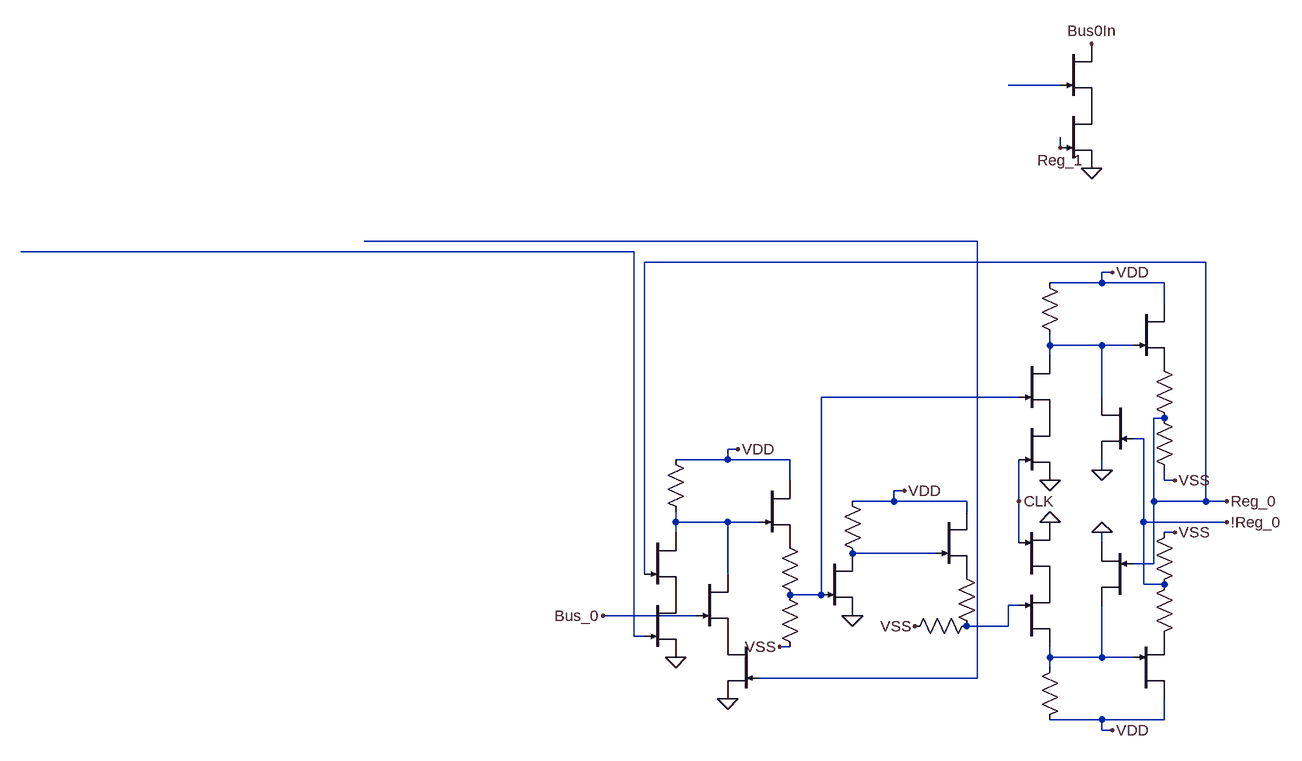
[diagram p0: schematic tile.asc]
tile.asc, the LTspice schematic file:
Version 4.1
SHEET 1 109444 42780
WIRE -4080 -1056 -4160 -1056
WIRE -4080 -960 -4080 -976
WIRE -4208 -816 -5152 -816
WIRE -4736 -800 -5680 -800
WIRE -3856 -784 -4720 -784
WIRE -4000 -768 -4016 -768
WIRE -4016 -752 -4016 -768
WIRE -4016 -752 -4096 -752
WIRE -3920 -752 -4016 -752
WIRE -3920 -720 -3920 -752
WIRE -4096 -656 -4096 -672
WIRE -4016 -656 -4096 -656
WIRE -3968 -656 -4016 -656
WIRE -4096 -640 -4096 -656
WIRE -4144 -576 -4448 -576
WIRE -4016 -576 -4016 -656
WIRE -3920 -544 -3936 -544
WIRE -3952 -512 -3968 -512
WIRE -4576 -496 -4592 -496
WIRE -4592 -480 -4592 -496
WIRE -4592 -480 -4672 -480
WIRE -4496 -480 -4592 -480
WIRE -4016 -464 -4016 -480
WIRE -4496 -448 -4496 -480
WIRE -3920 -448 -3920 -464
WIRE -3904 -448 -3920 -448
WIRE -4320 -432 -4336 -432
WIRE -4336 -416 -4336 -432
WIRE -4336 -416 -4400 -416
WIRE -4224 -416 -4336 -416
WIRE -4144 -416 -4144 -480
WIRE -3936 -416 -3936 -544
WIRE -3856 -416 -3856 -784
WIRE -3856 -416 -3936 -416
WIRE -3824 -416 -3856 -416
WIRE -4224 -400 -4224 -416
WIRE -4672 -384 -4672 -400
WIRE -4592 -384 -4672 -384
WIRE -4544 -384 -4592 -384
WIRE -3952 -384 -3952 -512
WIRE -3824 -384 -3952 -384
WIRE -4672 -368 -4672 -384
WIRE -3904 -368 -3920 -368
WIRE -4144 -352 -4144 -416
WIRE -4016 -352 -4016 -368
WIRE -4272 -336 -4400 -336
WIRE -3936 -320 -3936 -416
WIRE -3936 -320 -3968 -320
WIRE -4720 -304 -4720 -784
WIRE -4592 -304 -4592 -384
WIRE -3952 -288 -3952 -384
WIRE -3920 -288 -3952 -288
WIRE -4448 -272 -4448 -576
WIRE -4448 -272 -4496 -272
WIRE -4144 -256 -4160 -256
WIRE -4640 -240 -4784 -240
WIRE -4160 -224 -4160 -256
WIRE -4160 -224 -4224 -224
WIRE -4736 -208 -4736 -800
WIRE -4720 -208 -4736 -208
WIRE -4496 -192 -4512 -192
WIRE -4096 -176 -4096 -192
WIRE -4016 -176 -4016 -256
WIRE -4016 -176 -4096 -176
WIRE -3968 -176 -4016 -176
WIRE -4096 -160 -4096 -176
WIRE -4208 -144 -4208 -816
WIRE -4208 -144 -4544 -144
WIRE -4016 -80 -4096 -80
WIRE -3920 -80 -3920 -112
WIRE -3920 -80 -4016 -80
WIRE -4016 -64 -4016 -80
WIRE -4000 -64 -4016 -64
FLAG -4000 -768 VDD
FLAG -4000 -64 VDD
FLAG -3904 -368 VSS
FLAG -4096 -384 0
FLAG -4096 -448 0
FLAG -4016 -464 0
FLAG -4016 -368 0
FLAG -3904 -448 VSS
FLAG -4144 -416 CLK
FLAG -4592 -112 0
FLAG -4672 -176 0
FLAG -4400 -240 0
FLAG -4576 -496 VDD
FLAG -4320 -432 VDD
FLAG -4512 -192 VSS
FLAG -4304 -224 VSS
FLAG -4784 -240 Bus_0
FLAG -3824 -416 Reg_0
FLAG -3824 -384 !Reg_0
FLAG -4032 -928 0
FLAG -4032 -1120 Bus0In
FLAG -4080 -960 Reg_1
SYMBOL njf -4144 -640 R0
WINDOW 0 56 32 Invisible 2
WINDOW 3 56 72 Invisible 2
SYMATTR InstName J_A1
SYMATTR Value DR
SYMBOL res -4112 -768 R0
WINDOW 0 -35 57 Invisible 2
WINDOW 3 34 56 Invisible 2
SYMATTR InstName R1
SYMATTR Value 100k
SYMBOL njf -3968 -720 R0
WINDOW 0 56 32 Invisible 2
WINDOW 3 56 72 Invisible 2
SYMATTR InstName J_F1
SYMATTR Value DR
SYMBOL res -3936 -640 R0
WINDOW 0 -24 60 Invisible 2
WINDOW 3 34 58 Invisible 2
SYMATTR InstName R2
SYMATTR Value 1k
SYMBOL res -3936 -560 R0
WINDOW 0 -22 62 Invisible 2
WINDOW 3 37 62 Invisible 2
SYMATTR InstName R3
SYMATTR Value 4.8k
SYMBOL njf -3968 -576 M0
WINDOW 0 11 -7 Invisible 2
WINDOW 3 56 72 Invisible 2
SYMATTR InstName J_B1
SYMATTR Value DR
SYMBOL njf -4144 -192 M180
WINDOW 0 56 32 Invisible 2
WINDOW 3 56 72 Invisible 2
SYMATTR InstName J_A2
SYMATTR Value DR
SYMBOL res -4112 -64 M180
WINDOW 0 36 76 Invisible 2
WINDOW 3 36 40 Invisible 2
SYMATTR InstName R4
SYMATTR Value 100k
SYMBOL njf -3968 -112 M180
WINDOW 0 56 32 Invisible 2
WINDOW 3 56 72 Invisible 2
SYMATTR InstName J_F2
SYMATTR Value DR
SYMBOL res -3936 -192 M180
WINDOW 0 36 76 Invisible 2
WINDOW 3 36 40 Invisible 2
SYMATTR InstName R5
SYMATTR Value 1k
SYMBOL res -3936 -272 M180
WINDOW 0 36 76 Invisible 2
WINDOW 3 36 40 Invisible 2
SYMATTR InstName R6
SYMATTR Value 4.8k
SYMBOL njf -3968 -256 R180
WINDOW 0 56 32 Invisible 2
WINDOW 3 56 72 Invisible 2
SYMATTR InstName J_B2
SYMATTR Value DR
SYMBOL njf -4144 -544 R0
WINDOW 0 56 32 Invisible 2
WINDOW 3 56 72 Invisible 2
SYMATTR InstName J_A3
SYMATTR Value DR
SYMBOL njf -4144 -288 M180
WINDOW 0 56 32 Invisible 2
WINDOW 3 56 72 Invisible 2
SYMATTR InstName J_A4
SYMATTR Value DR
SYMBOL njf -4720 -368 R0
WINDOW 0 56 32 Invisible 2
WINDOW 3 56 72 Invisible 2
SYMATTR InstName J_A5
SYMATTR Value DR
SYMBOL res -4688 -496 R0
WINDOW 0 -35 57 Invisible 2
WINDOW 3 34 56 Invisible 2
SYMATTR InstName R7
SYMATTR Value 100k
SYMBOL njf -4544 -448 R0
WINDOW 0 56 32 Invisible 2
WINDOW 3 56 72 Invisible 2
SYMATTR InstName J_F3
SYMATTR Value DR
SYMBOL res -4512 -368 R0
WINDOW 0 -24 60 Invisible 2
WINDOW 3 34 58 Invisible 2
SYMATTR InstName R8
SYMATTR Value 1k
SYMBOL res -4512 -288 R0
WINDOW 0 -22 62 Invisible 2
WINDOW 3 37 62 Invisible 2
SYMATTR InstName R9
SYMATTR Value 4.8k
SYMBOL njf -4640 -304 R0
WINDOW 0 56 32 Invisible 2
WINDOW 3 56 72 Invisible 2
SYMATTR InstName J_B3
SYMATTR Value DR
SYMBOL njf -4448 -336 R0
WINDOW 0 56 32 Invisible 2
WINDOW 3 56 72 Invisible 2
SYMATTR InstName J_A6
SYMATTR Value DR
SYMBOL res -4416 -432 R0
WINDOW 0 56 32 Invisible 2
WINDOW 3 56 72 Invisible 2
SYMATTR InstName R10
SYMATTR Value 50k
SYMBOL njf -4272 -400 R0
WINDOW 0 56 32 Invisible 2
WINDOW 3 56 72 Invisible 2
SYMATTR InstName J_A7
SYMATTR Value DR
SYMBOL res -4240 -320 R0
WINDOW 0 37 24 Invisible 2
WINDOW 3 -30 25 Invisible 2
SYMATTR InstName R11
SYMATTR Value 1k
SYMBOL res -4208 -240 R90
WINDOW 0 59 66 Invisible 2
WINDOW 3 34 13 Invisible 2
SYMATTR InstName R12
SYMATTR Value 4.5k
SYMBOL njf -4720 -272 R0
WINDOW 0 56 32 Invisible 2
WINDOW 3 56 72 Invisible 2
SYMATTR InstName J_A8
SYMATTR Value DR
SYMBOL njf -4544 -208 M0
WINDOW 0 56 32 Invisible 2
WINDOW 3 56 72 Invisible 2
SYMATTR InstName J_B4
SYMATTR Value DR
SYMBOL njf -4080 -1024 R0
WINDOW 0 56 32 Invisible 2
WINDOW 3 56 72 Invisible 2
SYMATTR InstName J_A11
SYMATTR Value DR
SYMBOL njf -4080 -1120 R0
WINDOW 0 56 32 Invisible 2
WINDOW 3 56 72 Invisible 2
SYMATTR InstName J_A12
SYMATTR Value DR

The netlist it stands for:
* tile.asc
J_A1 N004 N005 P001 DR
R1 VDD N004 100k
J_F1 VDD N004 P002 DR
R2 P002 Reg_0 1k
R3 Reg_0 VSS 4.8k
J_B1 N004 !Reg_0 0 DR
J_A2 N009 N008 P003 DR
R4 VDD N009 100k
J_F2 VDD N009 P004 DR
R5 P004 !Reg_0 1k
R6 !Reg_0 VSS 4.8k
J_B2 N009 Reg_0 0 DR
J_A3 P001 CLK 0 DR
J_A4 P003 CLK 0 DR
J_A5 N006 Reg_0 P005 DR
R7 VDD N006 100k
J_F3 VDD N006 P006 DR
R8 P006 N005 1k
R9 N005 VSS 4.8k
J_B3 N006 Bus_0 P007 DR
J_A6 N007 N005 0 DR
R10 VDD N007 50k
J_A7 VDD N007 P008 DR
R11 P008 N008 1k
R12 N008 VSS 4.5k
J_A8 P005 N003 0 DR
J_B4 P007 N002 0 DR
J_A11 P009 Reg_1 0 DR
J_A12 Bus0In N001 P009 DR
.model NJF NJF
.model PJF PJF
.lib standard.jft
.backanno
.end